# EAGLE design EP_project_Receiver (EAGLE 9.6.2)
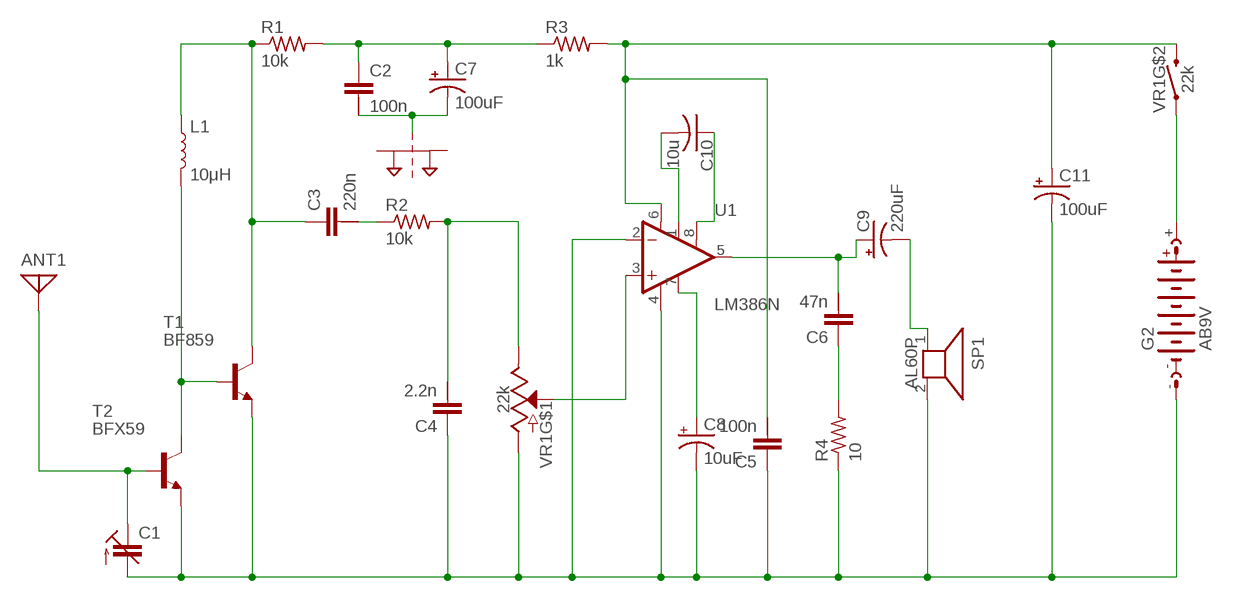
[diagram p0: schematic, sheet 1]

## Parts
ANT1  ANTENNA  [PAD-01]
C1  C-TRIMM808  [CTRIM808-BC]
C2  100n  C-2.5-5/5  [C2.5/5-5]
C3  220n  C-2.5-5/5  [C2.5/5-5]
C4  2.2n  C-2.5-5/5  [C2.5/5-5]
C5  100n  C-2.5-5/5  [C2.5/5-5]
C6  47n  C-2.5-5/5  [C2.5/5-5]
C7  100uF  560UF-PANASONIC_G-25V-20%  [PANASONIC_G]
C8  10uF  560UF-PANASONIC_G-25V-20%  [PANASONIC_G]
C9  220uF  560UF-PANASONIC_G-25V-20%  [PANASONIC_G]
C10  10u  C-US025-024X044  [C025-024X044]
C11  100uF  560UF-PANASONIC_G-25V-20%  [PANASONIC_G]
G2  AB9V  [AB9V]
L1  10μH  10μH_SHIELDED_INDUCTOR0805  [0805]
R1  10k  R-US_0204/7  [0204/7]
R2  10k  R-US_0204/7  [0204/7]
R3  1k  R-US_0204/7  [0204/7]
R4  10  R-US_0204/7  [0204/7]
SP1  AL60P  [AL60P]
SUPPLYTIE1  2PT_GND_TIE  [2PT_GND_TIE]
T1  BF859  [TO202]
T2  BFX59  [TO72]
U1  LM386N  LM386  [DIP08]
VR1  22k  POTENTIOMETER_W/SWITCHPOT_PTH_SWITCH  [POT-SWITCH-PTH]

## Nets
N$1: ANT1.1 C1.1(E) T2.2(B)
N$2: L1.2 T1.3(B) T2.3(C)
N$3: C3.1 L1.1 R1.1 T1.2(C)
N$4: C3.2 R2.1
N$5: C4.2 R2.2 VR1.3(E)
N$6: C1.2(A) C4.1 C5.1 C8.- C11.- G2.- R4.1 SP1.2 T1.1(E) T2.1(E) U1.2(-IN) U1.4(V-) VR1.1(A)
N$7: U1.3(+IN) VR1.2(S)
N$8: C9.- SP1.1
N$9: C2.1 C7.+ R1.2 R3.1
N$10: C2.2 C7.-
N$11: C5.2 C11.+ R3.2 U1.6(V+) VR1.S2
N$12: G2.+ VR1.S1
N$13: C6.1 R4.2
N$14: C6.2 C9.+ U1.5(OUT)
N$15: C8.+ U1.7(BP)
N$16: C10.1 U1.8(GAIN)
N$17: C10.2 U1.1(GAIN)
Unconnected: C2.3 C3.3 C4.3 C5.3 C6.3 SUPPLYTIE1.P$1 SUPPLYTIE1.P$2

## Library data of the parts
ANT1 = discrete:ANTENNA: Antenna
C1 = rcl:C-TRIMM: Trimm capacitor; SPICEPREFIX: C
C2-C6 = capacitor-wima:C-: CAPACITOR for alternative placement naming: default grid - extended grid/package width
C7-C9 C11 = SparkFun-Capacitors:560UF: 560µF polarized capacitors A capacitor is a passive two-terminal electrical component used to store electrical energy temporarily in an electric field.; PROD_ID: CAP-09983; VALUE: 560uF
C10 = rcl:C-US: CAPACITOR, American symbol; SPICEPREFIX: C
G2 = battery:AB9V: 9-V BATTERY CLIP
L1 = SparkFun-Coils:10μH_SHIELDED_INDUCTOR: Murata 10uH Inductor 10uH 60mA 400mOhm 0805 Package Shielded; PROD_ID: NDUC-13231
R1-R4 = rcl:R-US_: RESISTOR, American symbol; SPICEPREFIX: R
SP1 = buzzer:AL60P: SPEAKER Source: Buerklin; OC_FARNELL: unknown; OC_NEWARK: unknown
SUPPLYTIE1 = SparkFun-PowerSymbols:2PT_GND_TIE: Dual Ground Supply Power supply symbol for connecting two grounds. SparkFun Products: SparkFun AutoDriver - Stepper Motor Driver <https://www.sparkfun.com/products/11611>
T1 = transistor:BF859: NPN TRANSISTOR
T2 = transistor:BFX59: NPN TRANSISTOR
U1 = SparkFun-IC-Amplifiers:LM386: low voltage audio power amplifier SparkFun Products FabFM Radio Kit <https://www.sparkfun.com/products/11043> (KIT-11043); PROD_ID: IC-10899
VR1 = SparkFun-Resistors:POTENTIOMETER_W/SWITCH: Potentiometer (Pot) with Switch Three-terminal potentiometers, with an adjustable wiper and two adjustable resistors. A pot can be used to create a configurable voltage divider, or as a variable resistor. This potentiometer includes a "select" switch - actuated by pushing down on the wiper. Variants POT-SWITCH-PTH - 16mm PTH Pot w/ Switch Used on SparkFun FabFM Radio Kit <https://www.sparkfun.com/products/11043>; PROD_ID: RES-11300; VALUE: 1k

## Board
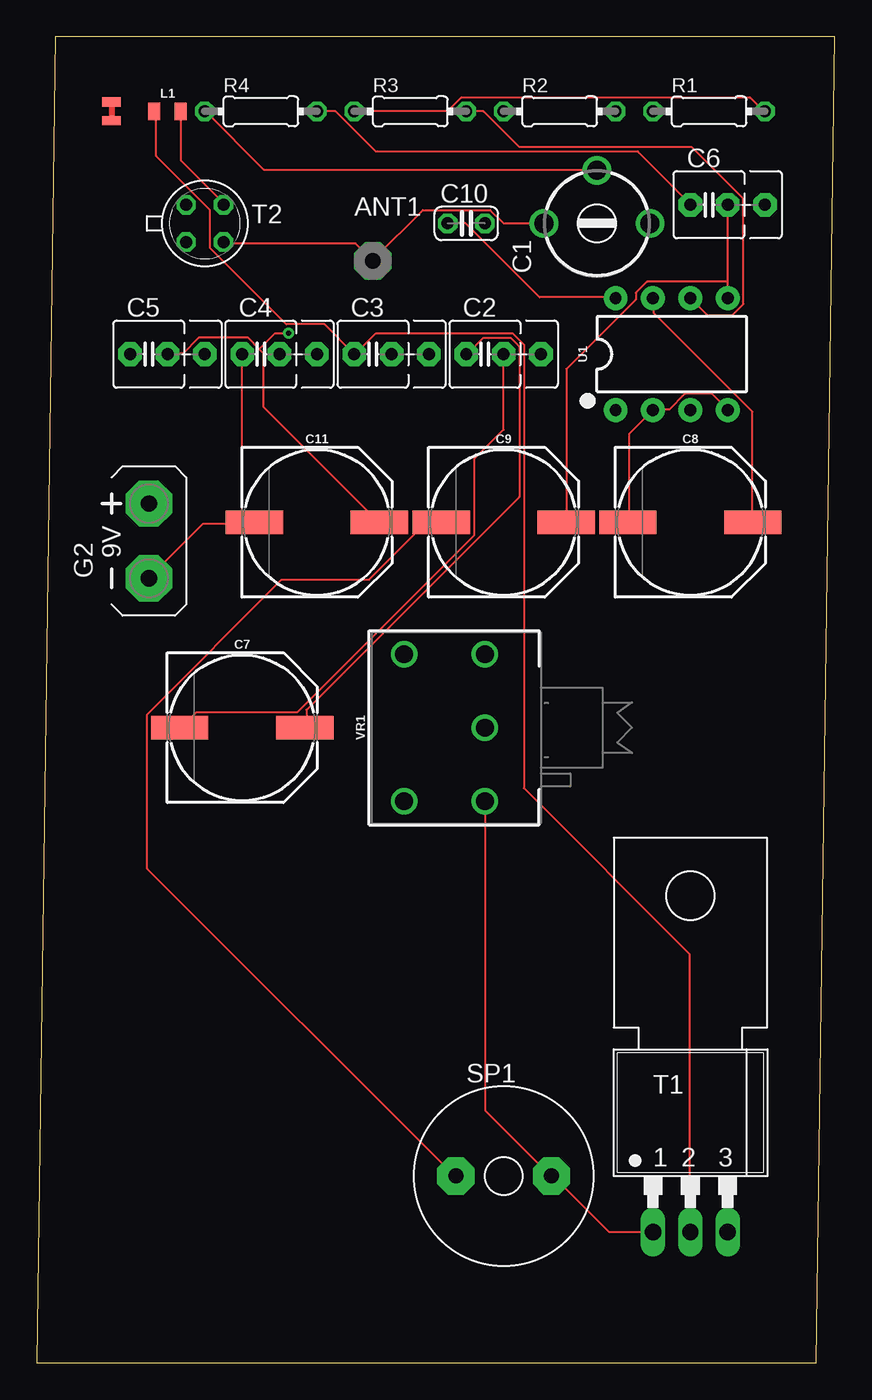
[diagram p1: board, top side]
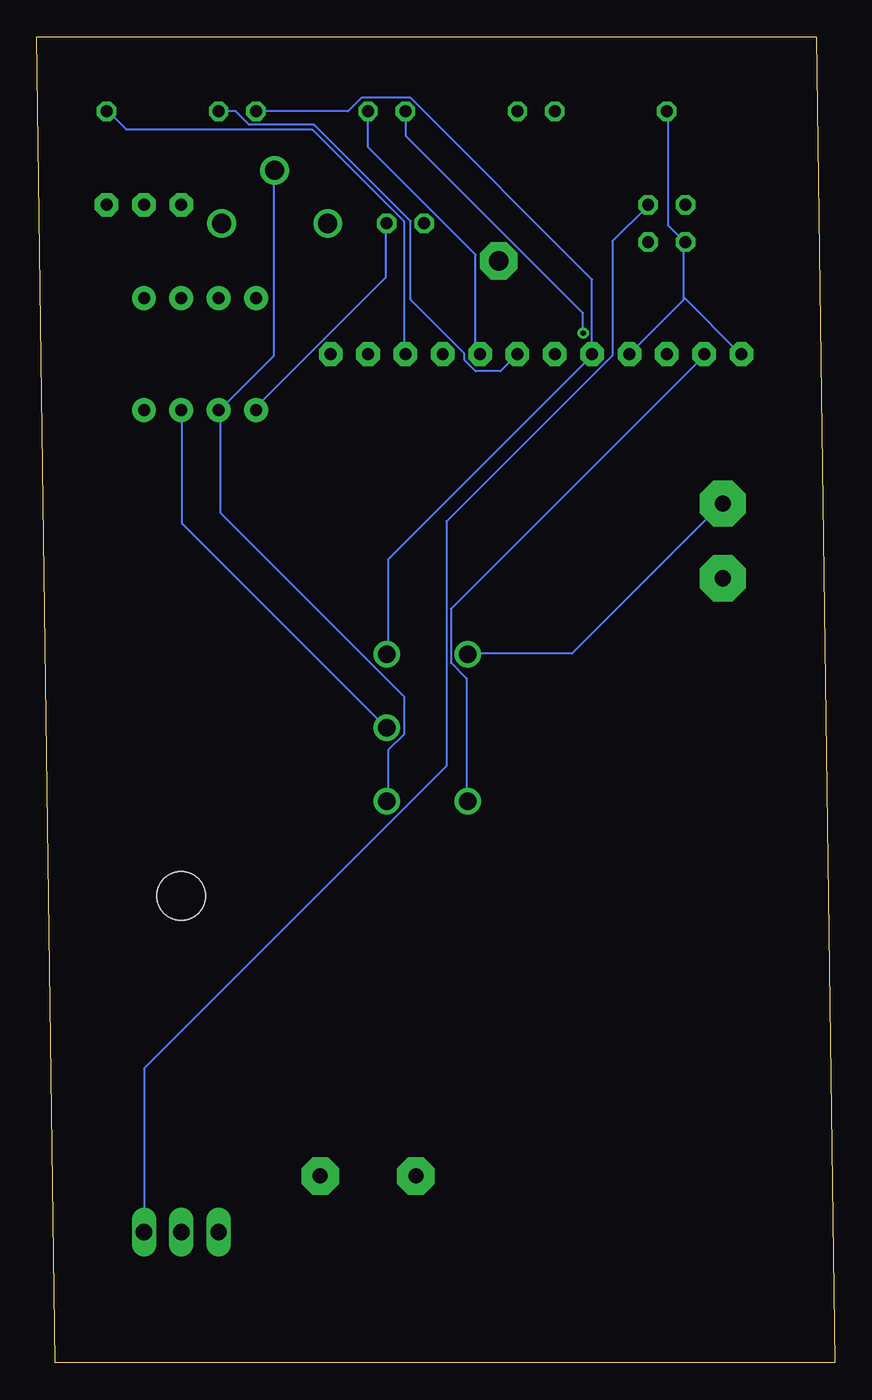
[diagram p2: board, bottom side, seen from below]

Size 54.28 x 90.16 mm. Coordinates in mm from the lower left corner, seen from the top.
Outline: 0,0 53.01,0 54.28,90.16 1.27,90.16 0,0
Copper layers (1*16): Top 0.035mm / dielectric 1.5mm / Bottom 0.035mm
Design rules "default": minimum track width 6mil, minimum drill 0.35mm, track to track 6mil, track to pad 6mil, pad to pad 6mil, via to via 6mil, smd to smd 6mil, copper to edge 40mil, drill to drill 6mil, minimum pad ring 10mil, minimum via ring 8mil, stop-mask expansion 4mil, vias tented up to drill 0mil, thermal gap 10mil

### Footprints (pad centres in the part's own frame; a part is rotated, then mirrored left to right if it is on the bottom)
PAD-01 = drill 1.321 pad 2.54 octagon: 1 0,0
CTRIM808-BC = drill 1.3: 1 -3.607,0; 2 0,3.607; 3 3.607,0
C2.5/5-5 = drill 0.813 pad 1.6 octagon: 1 -1.27,0; 2 1.27,0; 3 3.81,0
PANASONIC_G = smd 3.9 x 1.6: + 4.25,0; - -4.25,0
C025-024X044 = drill 0.813 octagon: 1 -1.27,0; 2 1.27,0
AB9V = drill 1.118 pad 3.15 octagon: + 0,2.54; - 0,-2.54
0805 = smd 0.8 x 1.2: 1 -0.9,0; 2 0.9,0
0204/7 = drill 0.813 octagon: 1 -3.81,0; 2 3.81,0
AL60P = drill 1.016 pad 2.54 octagon: 1 -3.251,0; 2 3.251,0
2PT_GND_TIE = smd 1.27 x 0.635: P$1 0,0.635; P$2 0,-0.635
TO202 = drill 1.118 long: 1 -2.54,-5.08; 2 0,-5.08; 3 2.54,-5.08 | hole 3.302: 0,17.78
TO72 = drill 0.813 octagon: 1 -1.27,-1.27; 2 1.27,-1.27; 3 1.27,1.27; 4 -1.27,1.27
DIP08 = drill 0.813 pad 1.626: 1 -3.81,-3.81; 2 -1.27,-3.81; 3 1.27,-3.81; 4 3.81,-3.81; 5 3.81,3.81; 6 1.27,3.81; 7 -1.27,3.81; 8 -3.81,3.81
POT-SWITCH-PTH = drill 1.2: 1 0,-5; 2 0,0; 3 0,5; S1 -5.5,5; S2 -5.5,-5

### Placement (x,y rotation side)
ANT1  22.86,74.93 0 top
C1  38.1,77.47 0 top
C2  30.48,68.58 0 top
C3  22.86,68.58 0 top
C4  15.24,68.58 0 top
C5  7.62,68.58 0 top
C6  45.72,78.74 0 top
C7  13.97,43.18 0 top
C8  44.45,57.15 0 top
C9  31.75,57.15 0 top
C10  29.21,77.47 0 top
C11  19.05,57.15 0 top
G2  7.62,55.88 0 top
L1  8.89,85.09 0 top
R1  45.72,85.09 0 top
R2  35.56,85.09 0 top
R3  25.4,85.09 0 top
R4  15.24,85.09 0 top
SP1  31.75,12.7 0 top
SUPPLYTIE1  5.08,85.09 0 top
T1  44.45,13.97 0 top
T2  11.43,77.47 0 top
U1  43.18,68.58 0 top
VR1  30.48,43.18 0 top

### Tracks (layer width: path | path; a pad name or v marks a point on that pad's centre or on a via)
N$1
  Top 0.152: T2.2 12.7,76.1 21.69,76.1 ANT1.1 22.91,75.03 26.26,78.38 30.84,78.38 31.75,77.47 C1.1
N$2
  Top 0.152: L1.2 9.8,85.09 9.8,81.74 12.7,78.84 T2.3
  Bottom 0.152: T1.3 46.99,20.02 26.42,40.59 26.42,57.2 15.14,68.48 15.14,76.25 12.7,78.69 T2.3
N$3
  Top 0.152: L1.1 8.13,85.09 8.13,82.04 11.79,78.38 11.79,75.79 16.97,70.61 19.56,70.61 C3.1 21.69,68.63 23.06,70 32.36,70 33.12,69.24 33.12,39.07 44.4,27.79 44.4,8.89 T1.2
  Bottom 0.152: R1.1 40.74,85.09 39.83,84.18 35.41,84.18 28.85,77.62 28.85,72.29 25.2,68.63 25.2,68.17 24.43,67.41 22.76,67.41 C3.1
N$4
  Bottom 0.152: R2.1 31.75,82.65 24.43,75.34 24.43,68.94 24.13,68.63 C3.2
N$5
  Bottom 0.152: R2.2 33.12,85.09 32.21,86 28.85,86 16.51,73.66 C4.2 16.51,68.48 30.38,54.61 30.38,48.21 VR1.3
N$6
  Top 0.152: T1.1 38.91,8.89 35.1,12.7 SP1.2 34.95,12.7 30.53,17.12 30.53,38.15 VR1.1 | U1.4 46.99,64.82 45.92,65.89 44.09,65.89 43.03,64.82 41.96,64.82 U1.2 40.28,63.14 40.28,57.2 C8.- | 13.92,57.05 11.33,57.05 G2.- | 13.92,57.05 14.68,57.05 C11.- 13.92,57.05 | 13.92,57.05 13.92,68.48 C4.1 | C1.2 38,81.13 15.44,81.13 11.48,85.09 R4.1
  Bottom 0.152: C1.2 38.15,80.97 38.15,68.48 41.81,64.82 U1.2 41.81,64.67 41.81,57.81 29.31,45.31 29.31,42.72 30.38,41.66 30.38,38.3 VR1.1 | 10.26,72.44 10.26,72.29 C4.1 | 10.26,72.44 10.26,76.1 T2.1 10.26,76.25 11.33,77.32 11.33,85.09 R4.1 | 10.26,72.44 6.45,68.63 C5.1
N$7
  Bottom 0.152: U1.3 44.4,64.67 44.4,57.05 30.53,43.18 VR1.2
N$8
  Top 0.152: C9.- 27.48,57.05 26.42,57.05 22.61,53.24 16.66,53.24 7.52,44.09 7.52,33.58 28.4,12.7 SP1.1
N$9
  Top 0.152: R3.1 27.94,85.09 28.85,86 48.51,86 49.43,85.09 R1.2 | C7.+ 18.34,43.18 18.34,44.4 32.82,58.88 32.82,69.09 32.21,69.7 30.38,69.7 29.31,68.63 C2.1
  Bottom 0.152: C2.1 29.31,68.63 29.31,77.62 35.56,83.87 48.21,83.87 49.43,85.09 R1.2
N$10
  Top 0.152: C2.2 31.75,63.45 29.77,61.47 29.77,56.29 17.73,44.25 10.87,44.25 9.8,43.18 C7.-
N$11  (via drill 0.35)
  Top 0.152: R3.2 30.38,85.09 32.82,82.65 44.55,82.65 48.06,79.15 48.06,71.98 47.3,71.22 45.62,71.22 U1.6 | 15.14,68.94 15.44,68.63 15.44,64.97 23.22,57.2 C11.+ | 15.14,68.94 14.38,69.7 11.02,69.7 9.96,68.63 8.89,68.63 C5.2 | v17.12,70 16.21,70 15.14,68.94
  Bottom 0.152: VR1.S2 25.04,38.3 25.04,46.53 26.11,47.6 26.11,51.26 8.89,68.48 C5.2 | v17.12,70 17.12,71.37 29.16,83.41 29.16,85.09 R3.2
N$12
  Bottom 0.152: VR1.S1 24.89,48.21 17.88,48.21 7.67,58.42 G2.+
N$13
  Top 0.152: R4.2 20.32,85.09 23.06,82.35 40.89,82.35 44.4,78.84 C6.1
N$14
  Top 0.152: U1.5 46.99,73.51 | 46.99,73.51 C6.2 | 46.99,73.51 41.5,73.51 40.74,72.75 40.74,72.29 36.02,67.56 36.02,57.2 C9.+
N$15
  Top 0.152: U1.7 41.96,72.29 41.96,71.37 48.67,64.67 48.67,57.2 C8.+
N$16
  Top 0.152: C10.1 29.16,77.47 34.19,72.44 39.37,72.44 U1.8
N$17
  Bottom 0.152: U1.1 39.37,64.97 30.53,73.81 30.53,77.47 C10.2